# Altium schematic sheet vme_can_fpga_conf.SchDoc: =GlobalProjectName
size 209 x 297 mm; SheetNumber: 7; SheetTotal: 8; PageSetup: Record=PageOptions|CenterHorizontal=True|CenterVertical=True|PrintScale=1.00|XCorrection=1.00|YCorrection=1.00|PrintKind=1|BorderSize=5000000|LeftOffset=0|BottomOffset=0|Orientation=2|PaperLength=1000|PaperWidth=1000|Scale=100|PaperSource=15|PrintQuality=1200|MediaType=1|DitherType=10|PaperKind=A3|PrintScaleMode=1; Weight: -; ScaleFactor: -
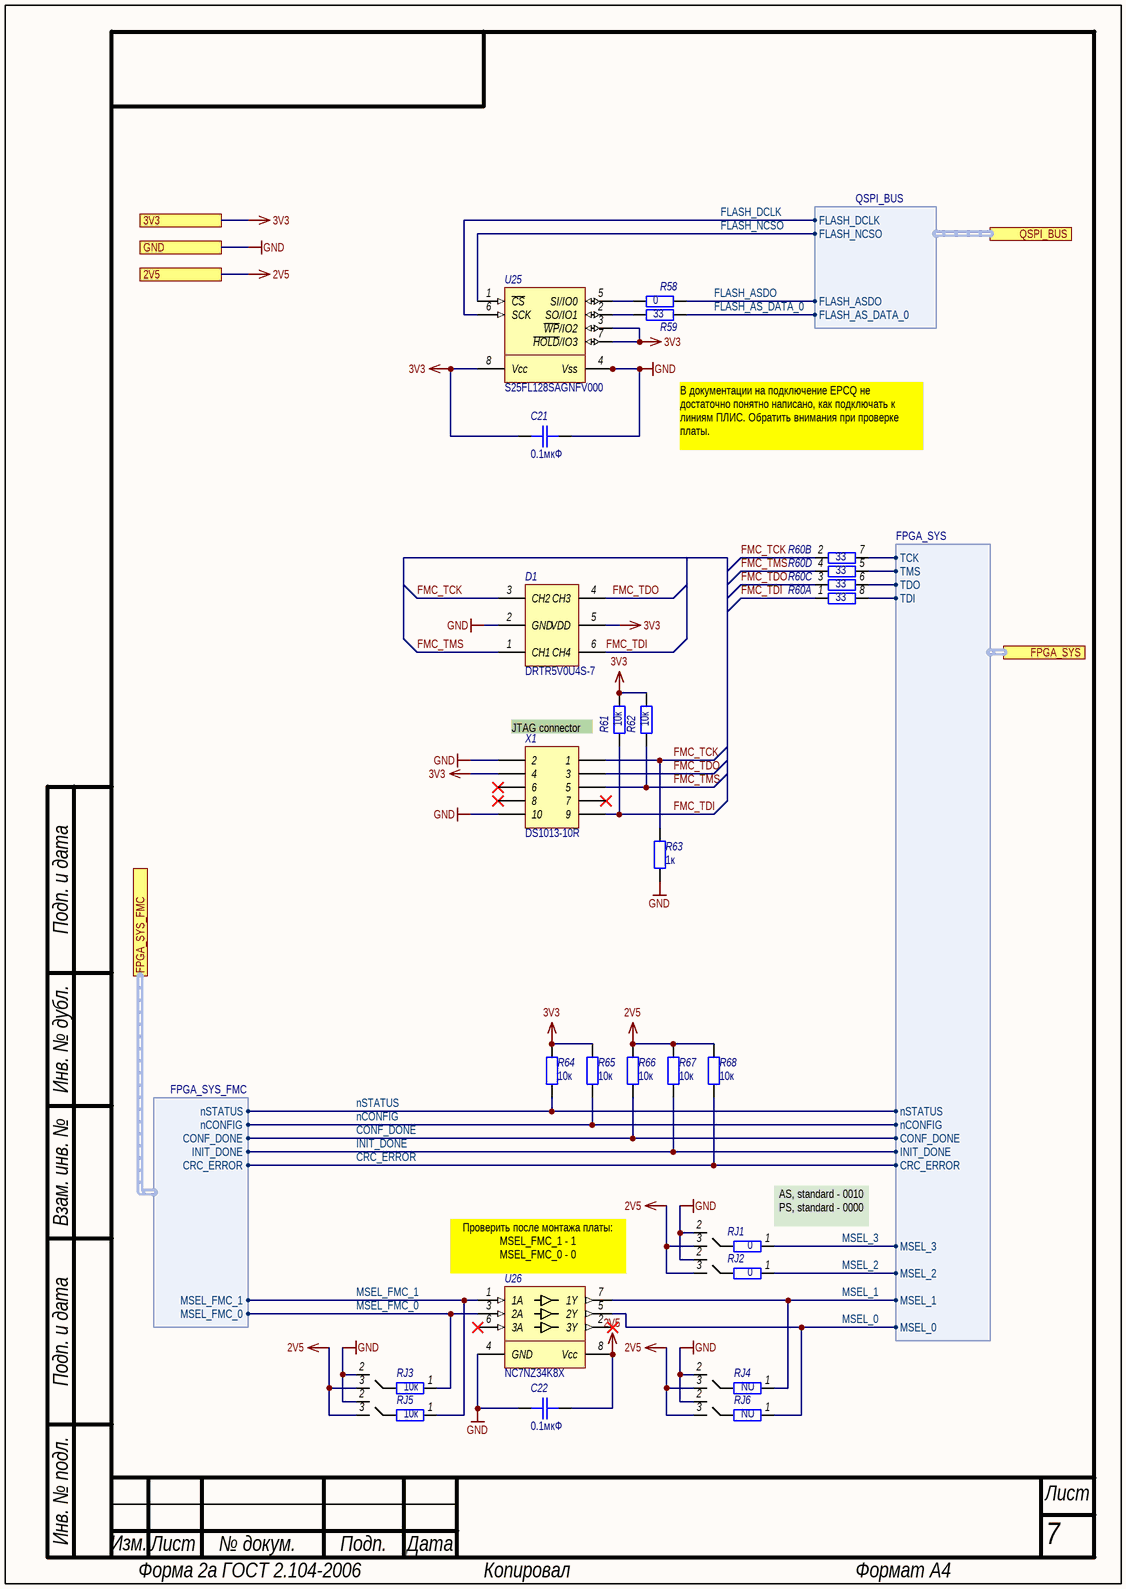
[diagram p0: vme_can_fpga_conf.SchDoc]

## Parts
C21  0.1мкФ  [SMD_C0402]
C22  0.1мкФ  [SMD_C0402]
D1  Наименование: DRTR5V0U4S-7  [SOT-363]  (hidden comment: DRTR5V0U4S)
R58  0  [SMD_0603]
R59  33  [SMD_0603]
R60  value 33  [TC124]  (hidden comment: 4 Chip Resistor Array)  (parts A,B,C,D of 4)
R61  10к  [SMD_0603]
R62  10к  [SMD_0603]
R63  1к  [SMD_0603]
R64  10к  [SMD_0603]
R65  10к  [SMD_0603]
R66  10к  [SMD_0603]
R67  10к  [SMD_0603]
R68  10к  [SMD_0603]
RJ1  0  [SMD_JMP_0603]
RJ2  0  [SMD_JMP_0603]
RJ3  10к  [SMD_JMP_0603]
RJ4  NU  [SMD_JMP_0603]
RJ5  10к  [SMD_JMP_0603]
RJ6  NU  [SMD_JMP_0603]
U25  Наименование: S25FL128SAGNFV000  [WSON-8_6x8]  (hidden comment: S25FL128SAGN)
U26  Наименование: NC7NZ34K8X  [US-8]  (hidden comment: NC7NZ34)
X1  DS1013-10R  [DS1013-10R]

## Ports
2V5, 3V3, FPGA_SYS (harness FPGA_SYS), FPGA_SYS_FMC (harness FPGA_SYS_FMC), GND, QSPI_BUS (harness QSPI_BUS)

## Harnesses
QSPI_BUS: FLASH_ASDO, FLASH_NCSO, FLASH_DCLK, FLASH_AS_DATA_0
FPGA_SYS: TCK, TMS, TDO, TDI, CRC_ERROR, INIT_DONE, nSTATUS, CONF_DONE, nCONFIG, MSEL_0, MSEL_1, MSEL_2, MSEL_3
FPGA_SYS_FMC: INIT_DONE, nSTATUS, CONF_DONE, nCONFIG, MSEL_FMC_0, MSEL_FMC_1, CRC_ERROR

## Nets
2V5: C22.2 R66.2 R67.2 R68.2 RJ1.3 RJ2.3 RJ3.3 RJ4.3 RJ5.3 RJ6.3 U26.8(Vcc) ; port 2V5
3V3: C21.2 D1.5(VDD) R61.2 R62.2 R64.2 R65.2 U25.3(~{WP}/IO2) U25.7(~{HOLD}/IO3) U25.8(Vcc) X1.4 ; port 3V3
GND: C21.1 C22.1 D1.2(GND) R63.1 RJ1.2 RJ2.2 RJ3.2 RJ4.2 RJ5.2 RJ6.2 U25.4(Vss) U25.9(TP) U26.4(GND) X1.2 X1.10 ; port GND
CONF_DONE: R66.1 ; port FPGA_SYS.CONF_DONE, port FPGA_SYS_FMC.CONF_DONE
CRC_ERROR: R68.1 ; port FPGA_SYS.CRC_ERROR, port FPGA_SYS_FMC.CRC_ERROR
FLASH_AS_DATA_0: R59.2 ; port QSPI_BUS.FLASH_AS_DATA_0
FLASH_ASDO: R58.2 ; port QSPI_BUS.FLASH_ASDO
FLASH_DCLK: U25.6(SCK) ; port QSPI_BUS.FLASH_DCLK
FLASH_NCSO: U25.1(~{CS}) ; port QSPI_BUS.FLASH_NCSO
FMC_TCK: D1.3(СH2) R60.2 R63.2 X1.1
FMC_TDI: D1.6(СH4) R60.1 R61.1 X1.9
FMC_TDO: D1.4(СH3) R60.3 X1.3
FMC_TMS: D1.1(СH1) R60.4 R62.1 X1.5
INIT_DONE: R67.1 ; port FPGA_SYS.INIT_DONE, port FPGA_SYS_FMC.INIT_DONE
MSEL_0: RJ6.1 U26.5(2Y) ; port FPGA_SYS.MSEL_0
MSEL_1: RJ4.1 U26.7(1Y) ; port FPGA_SYS.MSEL_1
MSEL_2: RJ2.1 ; port FPGA_SYS.MSEL_2
MSEL_3: RJ1.1 ; port FPGA_SYS.MSEL_3
MSEL_FMC_0: RJ3.1 U26.3(2A) ; port FPGA_SYS_FMC.MSEL_FMC_0
MSEL_FMC_1: RJ5.1 U26.1(1A) ; port FPGA_SYS_FMC.MSEL_FMC_1
nCONFIG: R65.1 ; port FPGA_SYS.nCONFIG, port FPGA_SYS_FMC.nCONFIG
nSTATUS: R64.1 ; port FPGA_SYS.nSTATUS, port FPGA_SYS_FMC.nSTATUS
NetR58_1: R58.1 U25.5(SI/IO0)
NetR59_1: R59.1 U25.2(SO/IO1)
NetR60_5: R60.5 ; port FPGA_SYS.TMS
NetR60_6: R60.6 ; port FPGA_SYS.TDO
NetR60_7: R60.7 ; port FPGA_SYS.TCK
NetR60_8: R60.8 ; port FPGA_SYS.TDI

Not connected (* = marked no-connect by the designer): U26 2(3Y)* 6(3A)*; X1 6* 7* 8*

## Notes on the sheet
- В документации на подключение EPCQ не достаточно понятно написано, как подключать к линиям ПЛИС. Обратить внимания при проверке платы.
- JTAG connector
- (near U26) Проверить после монтажа платы:
  MSEL_FMC_1 - 1
  MSEL_FMC_0 - 0
- (near RJ1) AS, standard - 0010
  PS, standard - 0000
- Подп. и дата
- Инв. № дубл.
- Взам. инв. №
- Инв. № подл.
- Изм.
- Лист
- № докум.
- Подп.
- Дата
- Форма 2а ГОСТ 2.104-2006
- Копировал
- Формат А4

## Library data of the parts
C21 C22 = Capacitor: Назначение: SMD-конденсатор; Наименование: Конденсатор; Потребление, Вт: 0; Value: 0.1мкФ
D1 = DRTR5V0U4S: 4 CHANNEL LOW CAPACITANCE TVS DIODE ARRAY; Потребление, Вт: 0.0; Назначение: 4 CHANNEL LOW CAPACITANCE TVS DIODE ARRAY; ComponentLink1Description: DataSheet; ComponentLink1URL: DRTR5V0U4S; Supplier 1: Digi-Key; Supplier Part Number 1: DRTR5V0U4S-7DICT-ND
R58 R59 = Resistor: PE1206DRM470R01L; Наименование: Резистор; Назначение: SMD-резистор; Потребление, Вт: 0,001
  R58: Value: 0
  R59: Value: 33
R60 = Resistor-4: Потребление, Вт: 0.0; Наименование: TC124-FR-0733RL; Назначение: 4 Chip Resistor Array; Описание: TC124-FR-0733RL
R61-R68 = Resistor: Наименование: Резистор; Назначение: SMD-резистор; Потребление, Вт: 0,001
  R61 R62 R64-R68: Value: 10к
  R63: Value: 1к
RJ1-RJ6 = Resistor_Jamper: Resistor-Jumper; Назначение: Резистор для выбора режима; Наименование: Резистор; Потребление, Вт: 0,0
  RJ1 RJ2: Value: 0
  RJ3 RJ5: Value: 10к
  RJ4 RJ6: Value: NU
U25 = S25FL128SAGN: Programmable NOR flash memory; Потребление, Вт: 0.1; Назначение: Programmable NOR flash memory
U26 = NC7NZ34: TinyLogic UHS Triple Buffer; Потребление, Вт: 0.01; Назначение: TinyLogic UHS Triple Buffer; ComponentLink1Description: DataSheet; ComponentLink1URL: https://www.onsemi.com/pdf/datasheet/nc7nz34-d.pdf; Supplier 1: Digi-Key; Supplier Part Number 1: NC7NZ34K8XCT-ND
X1 = Header 2X10: Header, 10-Pin, Dual row; Потребление, Вт: 0,0; Назначение: Header, 10-Pin, Dual row; Наименование: DS1013-10R